# EasyEDA schematic Prática-11.json
TITLE: Sheet_1; REV: 1.0; Date: 2020-11-08; Sheet: 1/1; Company: Your Company
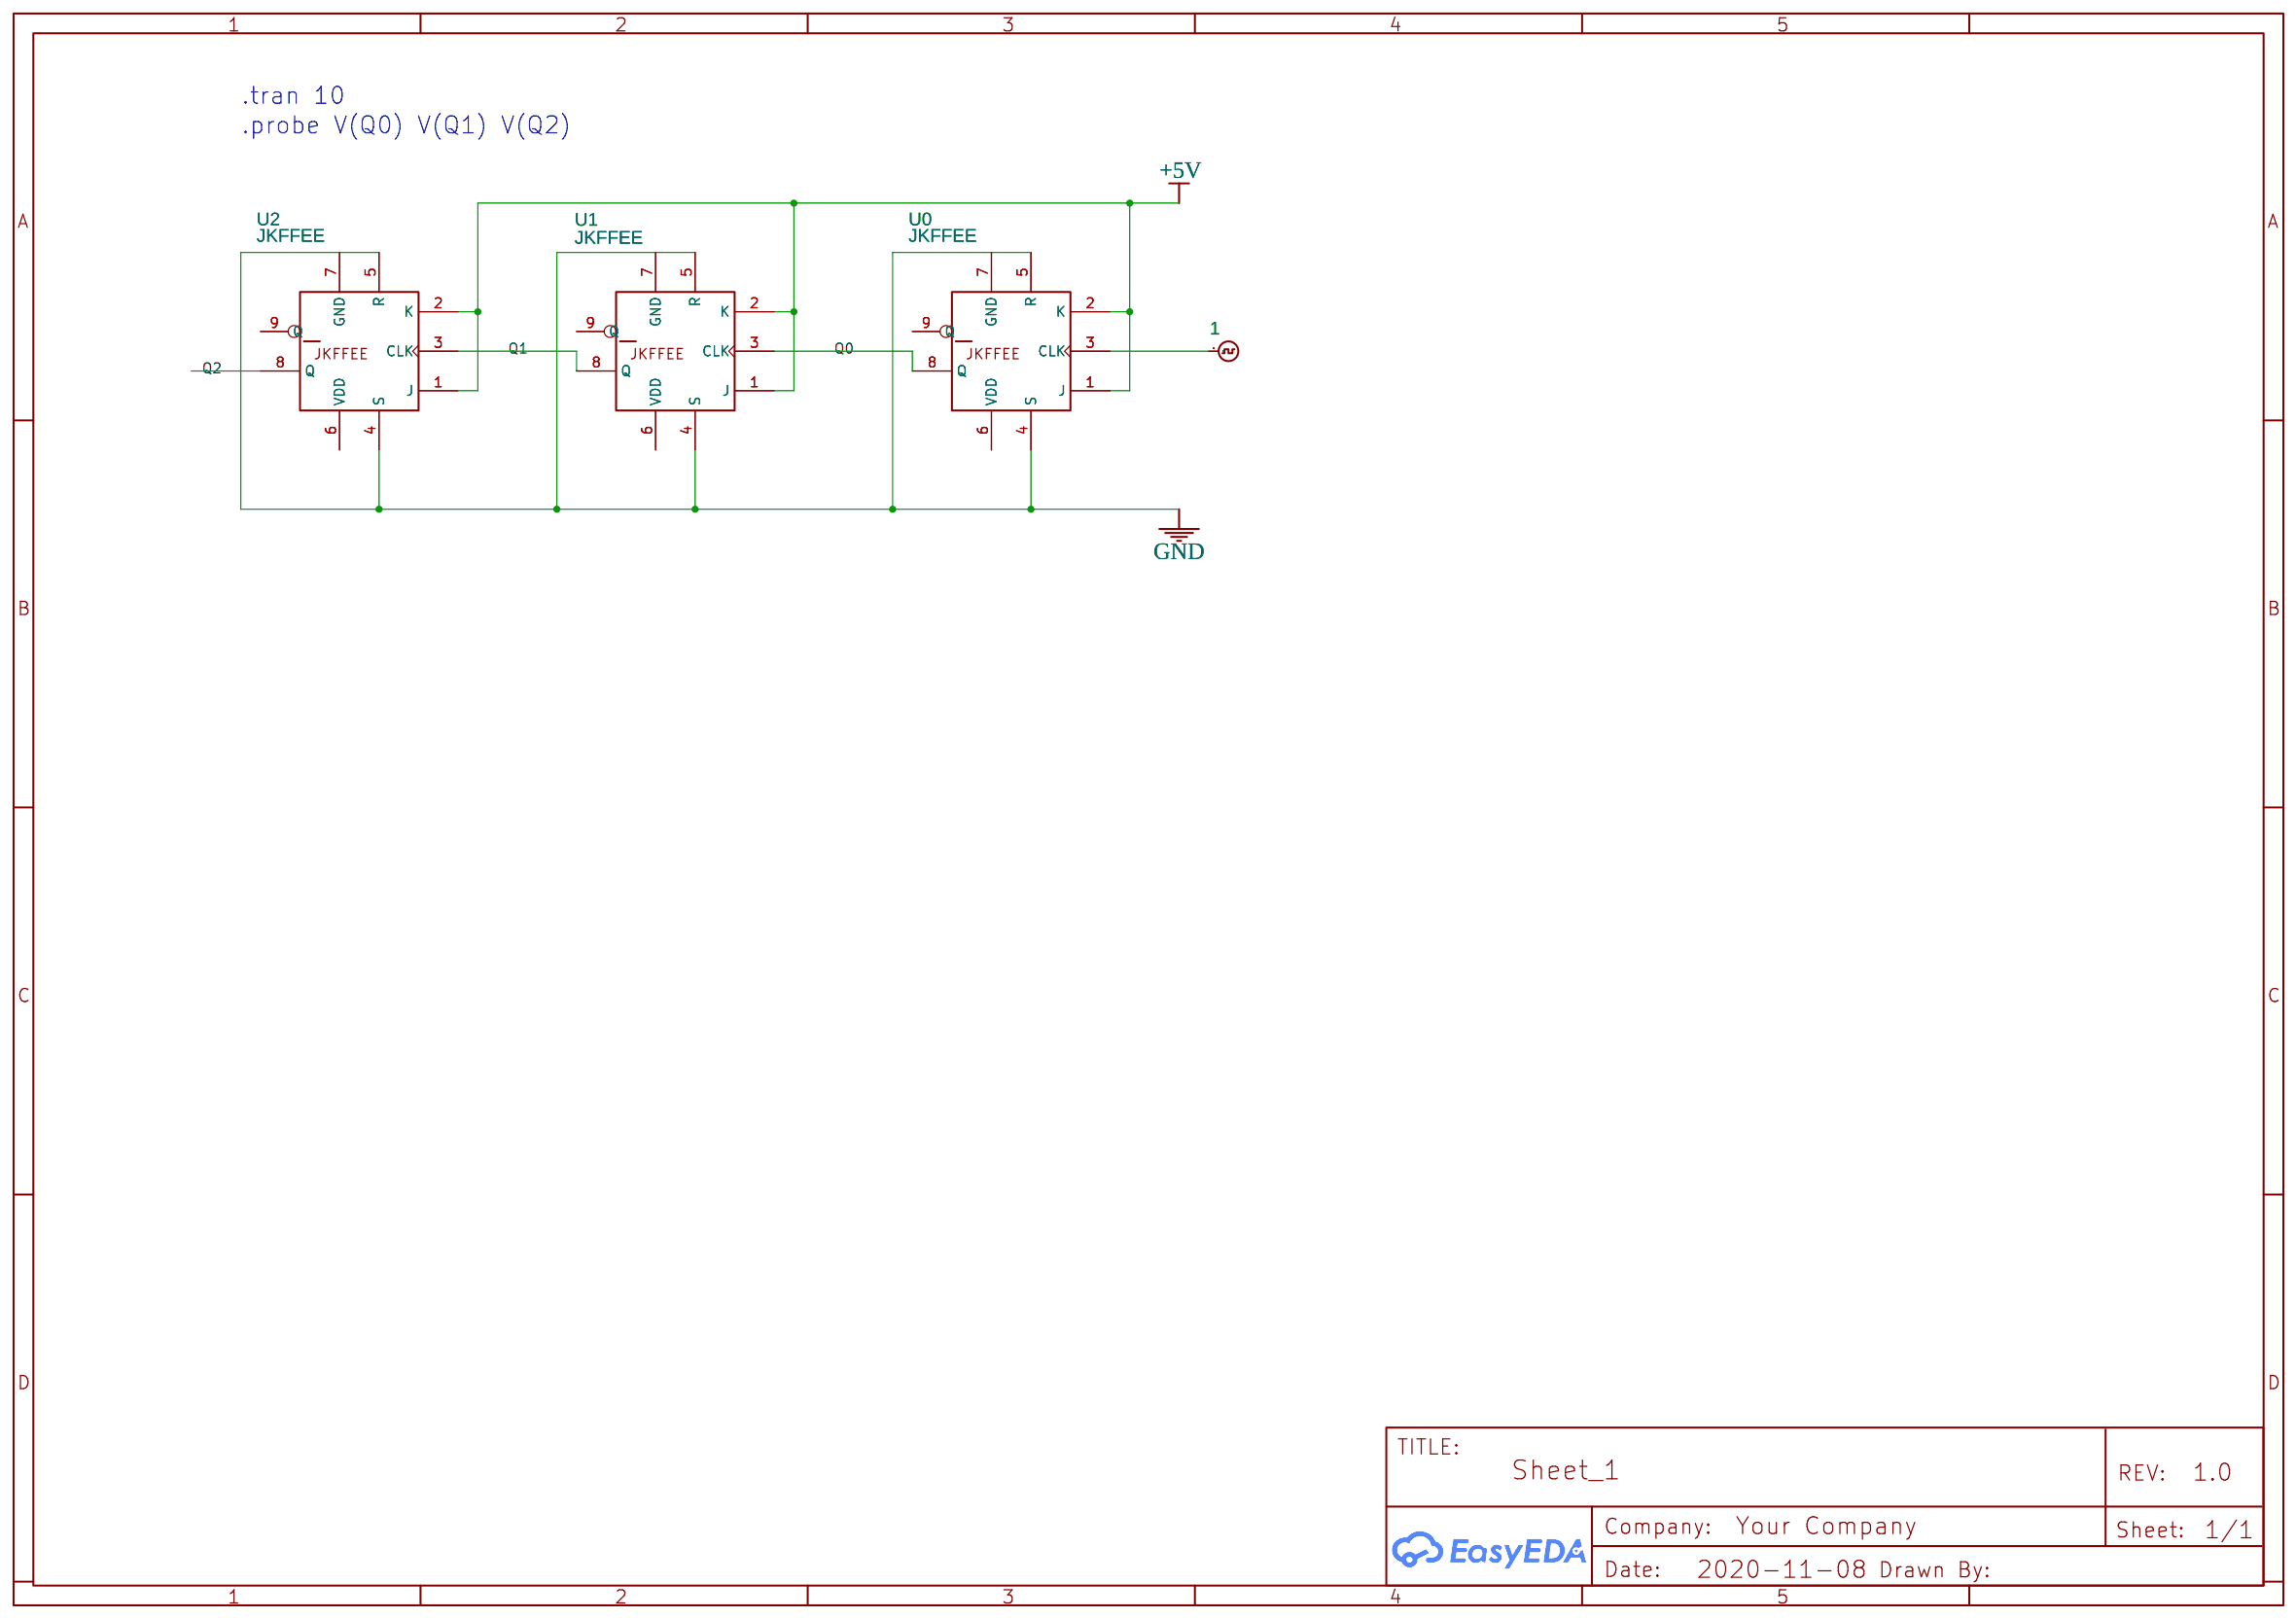
[diagram p0: schematic sheet]

## Parts
U0  JKFFEE
U1  JKFFEE
U2  JKFFEE
U3  1

## Library data of the parts
U0-U2 = LOGIC: Contributor: EasyEDA; sourceId: 8C82kBTN5; Supplier: YUJING
U3 = DIGITALCLOCK: Contributor: EasyEDA; PreDisplay: 0

## Nets
+5V: U0.1(J) U0.2(K) U1.1(J) U1.2(K) U2.1(J) U2.2(K)
GND: U0.4(S) U0.5(R) U1.4(S) U1.5(R) U2.4(S) U2.5(R)
Q0: U0.8(Q) U1.3(CLK)
Q1: U1.8(Q) U2.3(CLK)
Q2: U2.8(Q)
Net-(U0-3): U0.3(CLK) U3.1

Not connected (* = marked no-connect by the designer): U0 6(VDD) 7(GND) 9(Q); U1 6(VDD) 7(GND) 9(Q); U2 6(VDD) 7(GND) 9(Q)

## Notes on the sheet
- .tran 10
- .probe V(Q0) V(Q1) V(Q2)
